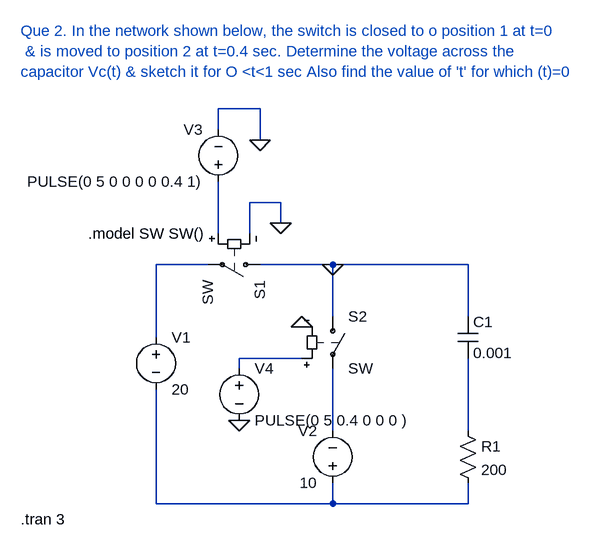
[diagram p0: schematic 2_Dheerendra_23EE019_Transient.asc]
2_Dheerendra_23EE019_Transient.asc, the LTspice schematic file:
Version 4
SHEET 1 1140 680
WIRE 224 -208 160 -208
WIRE 160 -176 160 -208
WIRE 224 -160 224 -208
WIRE 256 -64 208 -64
WIRE 256 -32 256 -64
WIRE 160 -16 160 -96
WIRE 208 -16 208 -64
WIRE 144 32 64 32
WIRE 336 32 224 32
WIRE 544 32 336 32
WIRE 336 112 336 32
WIRE 544 112 544 32
WIRE 64 144 64 32
WIRE 288 176 192 176
WIRE 192 192 192 176
WIRE 336 288 336 192
WIRE 544 288 544 176
WIRE 64 400 64 224
WIRE 336 400 336 368
WIRE 336 400 64 400
WIRE 544 400 544 368
WIRE 544 400 336 400
FLAG 224 -160 0
FLAG 256 -32 0
FLAG 288 128 0
FLAG 192 272 0
FLAG 336 32 0
SYMBOL voltage 64 128 R0
WINDOW 123 0 0 Left 0
WINDOW 39 0 0 Left 0
SYMATTR InstName V1
SYMATTR Value 20
SYMBOL sw 240 32 R90
SYMATTR InstName S1
SYMBOL sw 336 96 R0
SYMATTR InstName S2
SYMBOL cap 528 112 R0
SYMATTR InstName C1
SYMATTR Value 0.001
SYMBOL res 528 272 R0
SYMATTR InstName R1
SYMATTR Value 200
SYMBOL voltage 336 384 R180
WINDOW 0 24 96 Left 2
WINDOW 3 24 16 Left 2
WINDOW 123 0 0 Left 0
WINDOW 39 0 0 Left 0
SYMATTR InstName V2
SYMATTR Value 10
SYMBOL voltage 160 -80 R180
WINDOW 0 24 96 Left 2
WINDOW 3 24 16 Left 2
WINDOW 123 0 0 Left 0
WINDOW 39 0 0 Left 0
SYMATTR InstName V3
SYMATTR Value PULSE(0 5 0 0 0 0 0.4 1)
SYMBOL voltage 192 176 R0
WINDOW 123 0 0 Left 0
WINDOW 39 0 0 Left 0
SYMATTR InstName V4
SYMATTR Value PULSE(0 5 0.4 0 0 0 )
TEXT -40 -16 Left 2 !.model SW SW()
TEXT -144 424 Left 2 !.tran 3
TEXT -144 -328 Left 2 ;Que 2. In the network shown below, the switch is closed to o position 1 at t=0\n & is moved to position 2 at t=0.4 sec. Determine the voltage across the \ncapacitor Vc(t) & sketch it for O <t<1 sec Also find the value of 't' for which (t)=0

The netlist it stands for:
* 2_Dheerendra_23EE019_Transient.asc
V1 N002 N006 20
S1 0 N002 N001 0 SW
S2 0 N004 N003 0 SW
C1 0 N005 0.001
R1 N005 N006 200
V2 N006 N004 10
V3 N001 0 PULSE(0 5 0 0 0 0 0.4 1)
V4 N003 0 PULSE(0 5 0.4 0 0 0 )
.model SW SW()
.tran 3
* Que 2. In the network shown below, the switch is closed to o position 1 at t=0
*  & is moved to position 2 at t=0.4 sec. Determine the voltage across the
* capacitor Vc(t) & sketch it for O <t<1 sec Also find the value of 't' for which (t)=0
.backanno
.end